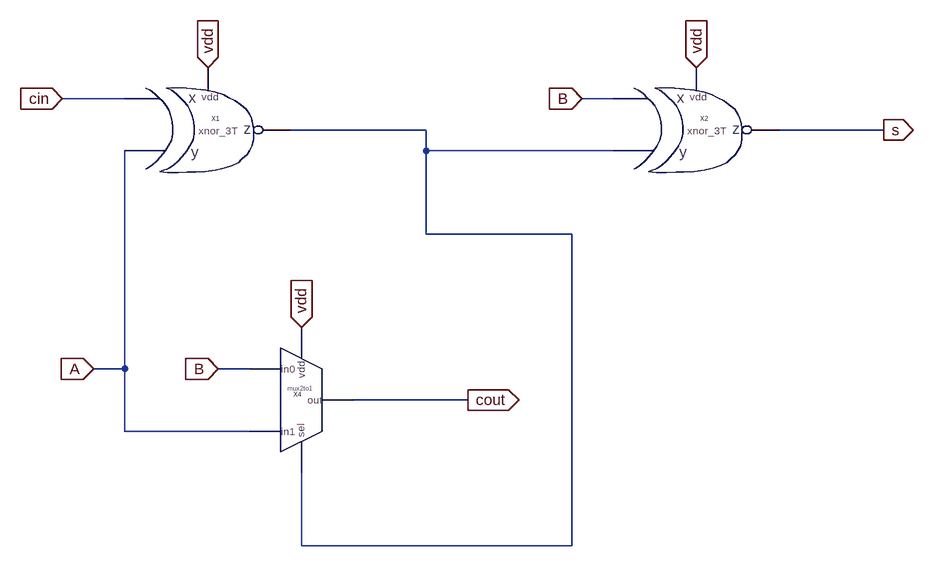
[diagram p0: schematic SingleBitAdder_12T_xnor.asc]
SingleBitAdder_12T_xnor.asc, the LTspice schematic file:
Version 4
SHEET 1 1764 924
WIRE 160 176 64 176
WIRE 912 176 864 176
WIRE 624 224 416 224
WIRE 1328 224 1168 224
WIRE 624 256 624 224
WIRE 912 256 624 256
WIRE 624 384 624 256
WIRE 848 384 624 384
WIRE 160 592 160 256
WIRE 160 592 112 592
WIRE 352 592 304 592
WIRE 688 640 512 640
WIRE 160 688 160 592
WIRE 352 688 160 688
WIRE 432 864 432 752
WIRE 848 864 848 384
WIRE 848 864 432 864
FLAG 1040 128 vdd
IOPIN 1040 128 In
FLAG 112 592 A
IOPIN 112 592 In
FLAG 1328 224 s
IOPIN 1328 224 Out
FLAG 688 640 cout
IOPIN 688 640 Out
FLAG 64 176 cin
IOPIN 64 176 In
FLAG 864 176 B
IOPIN 864 176 In
FLAG 288 128 vdd
IOPIN 288 128 In
FLAG 304 592 B
IOPIN 304 592 In
FLAG 432 528 vdd
IOPIN 432 528 In
SYMBOL mux2to1 336 640 R0
SYMATTR InstName X4
SYMBOL xnor_3T 272 224 R0
SYMATTR InstName X1
SYMBOL xnor_3T 1024 224 R0
SYMATTR InstName X2

The netlist it stands for:
* SingleBitAdder_12T_xnor.asc
XX4 B A vdd N001 cout mux2to1  ; pins in0 in1 vdd sel out
XX1 cin A N001 vdd xnor_3T  ; pins x y z vdd
XX2 B N001 s vdd xnor_3T  ; pins x y z vdd
.backanno
.end